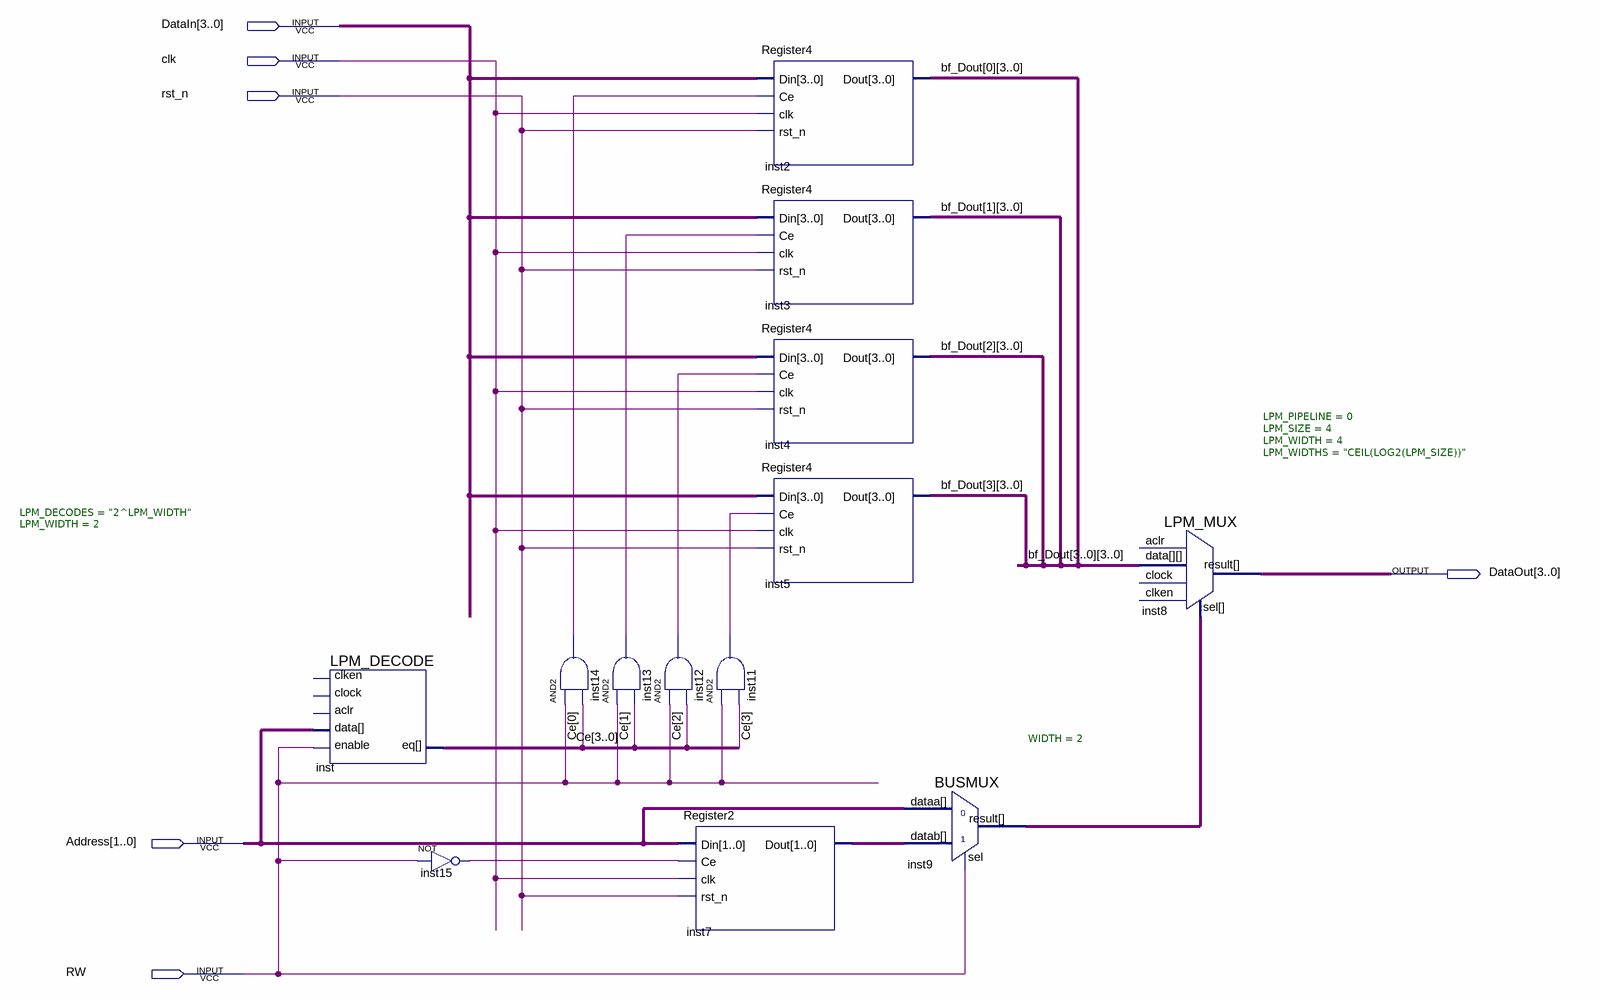
[diagram p0: schematic sheet]
// Quartus schematic SRAM4x4.bdf as structural Verilog: 13 symbols, 6 pins
module SRAM4x4 (
  input  [3:0] DataIn,
  input  clk,
  input  rst_n,
  input  [1:0] Address,
  input  RW,
  output [3:0] DataOut
);

  wire inst11_out, inst12_out, inst13_out, inst14_out, inst15_out;
  wire [1:0] inst7_dout, inst9_result;
  wire [3:0] bf_Dout_0, bf_Dout_1, bf_Dout_2, bf_Dout_3, Ce;

  LPM_DECODE #(.LPM_DECODES("2^LPM_WIDTH"), .LPM_WIDTH(2)) inst (
    .enable(RW), .data(Address), .eq(Ce));  // open: clken, clock, aclr
  not inst15 (inst15_out, RW);
  and inst14 (inst14_out, RW, Ce[0]);
  and inst13 (inst13_out, RW, Ce[1]);
  and inst12 (inst12_out, RW, Ce[2]);
  Register2 inst7 (.Din(Address), .Ce(inst15_out), .clk(clk), .rst_n(rst_n), .Dout(inst7_dout));
  Register4 inst2 (.Din(DataIn), .Ce(inst14_out), .clk(clk), .rst_n(rst_n), .Dout(bf_Dout_0));
  Register4 inst3 (.Din(DataIn), .Ce(inst13_out), .clk(clk), .rst_n(rst_n), .Dout(bf_Dout_1));
  Register4 inst4 (.Din(DataIn), .Ce(inst12_out), .clk(clk), .rst_n(rst_n), .Dout(bf_Dout_2));
  Register4 inst5 (.Din(DataIn), .Ce(inst11_out), .clk(clk), .rst_n(rst_n), .Dout(bf_Dout_3));
  and inst11 (inst11_out, RW, Ce[3]);
  BUSMUX #(.WIDTH(2)) inst9 (.datab(inst7_dout), .sel(RW), .dataa(Address), .result(inst9_result));
  LPM_MUX #(.LPM_PIPELINE(0), .LPM_SIZE(4), .LPM_WIDTH(4), .LPM_WIDTHS("CEIL(LOG2(LPM_SIZE))")) inst8 (
    .data({bf_Dout_3, bf_Dout_2, bf_Dout_1, bf_Dout_0}), .sel(inst9_result), .result(DataOut));  // open: clock, aclr, clken
endmodule
